# EAGLE design OPEN DROP DIGISCOPE BOARD 1 v2 RELAYS (EAGLE 9.3.0)
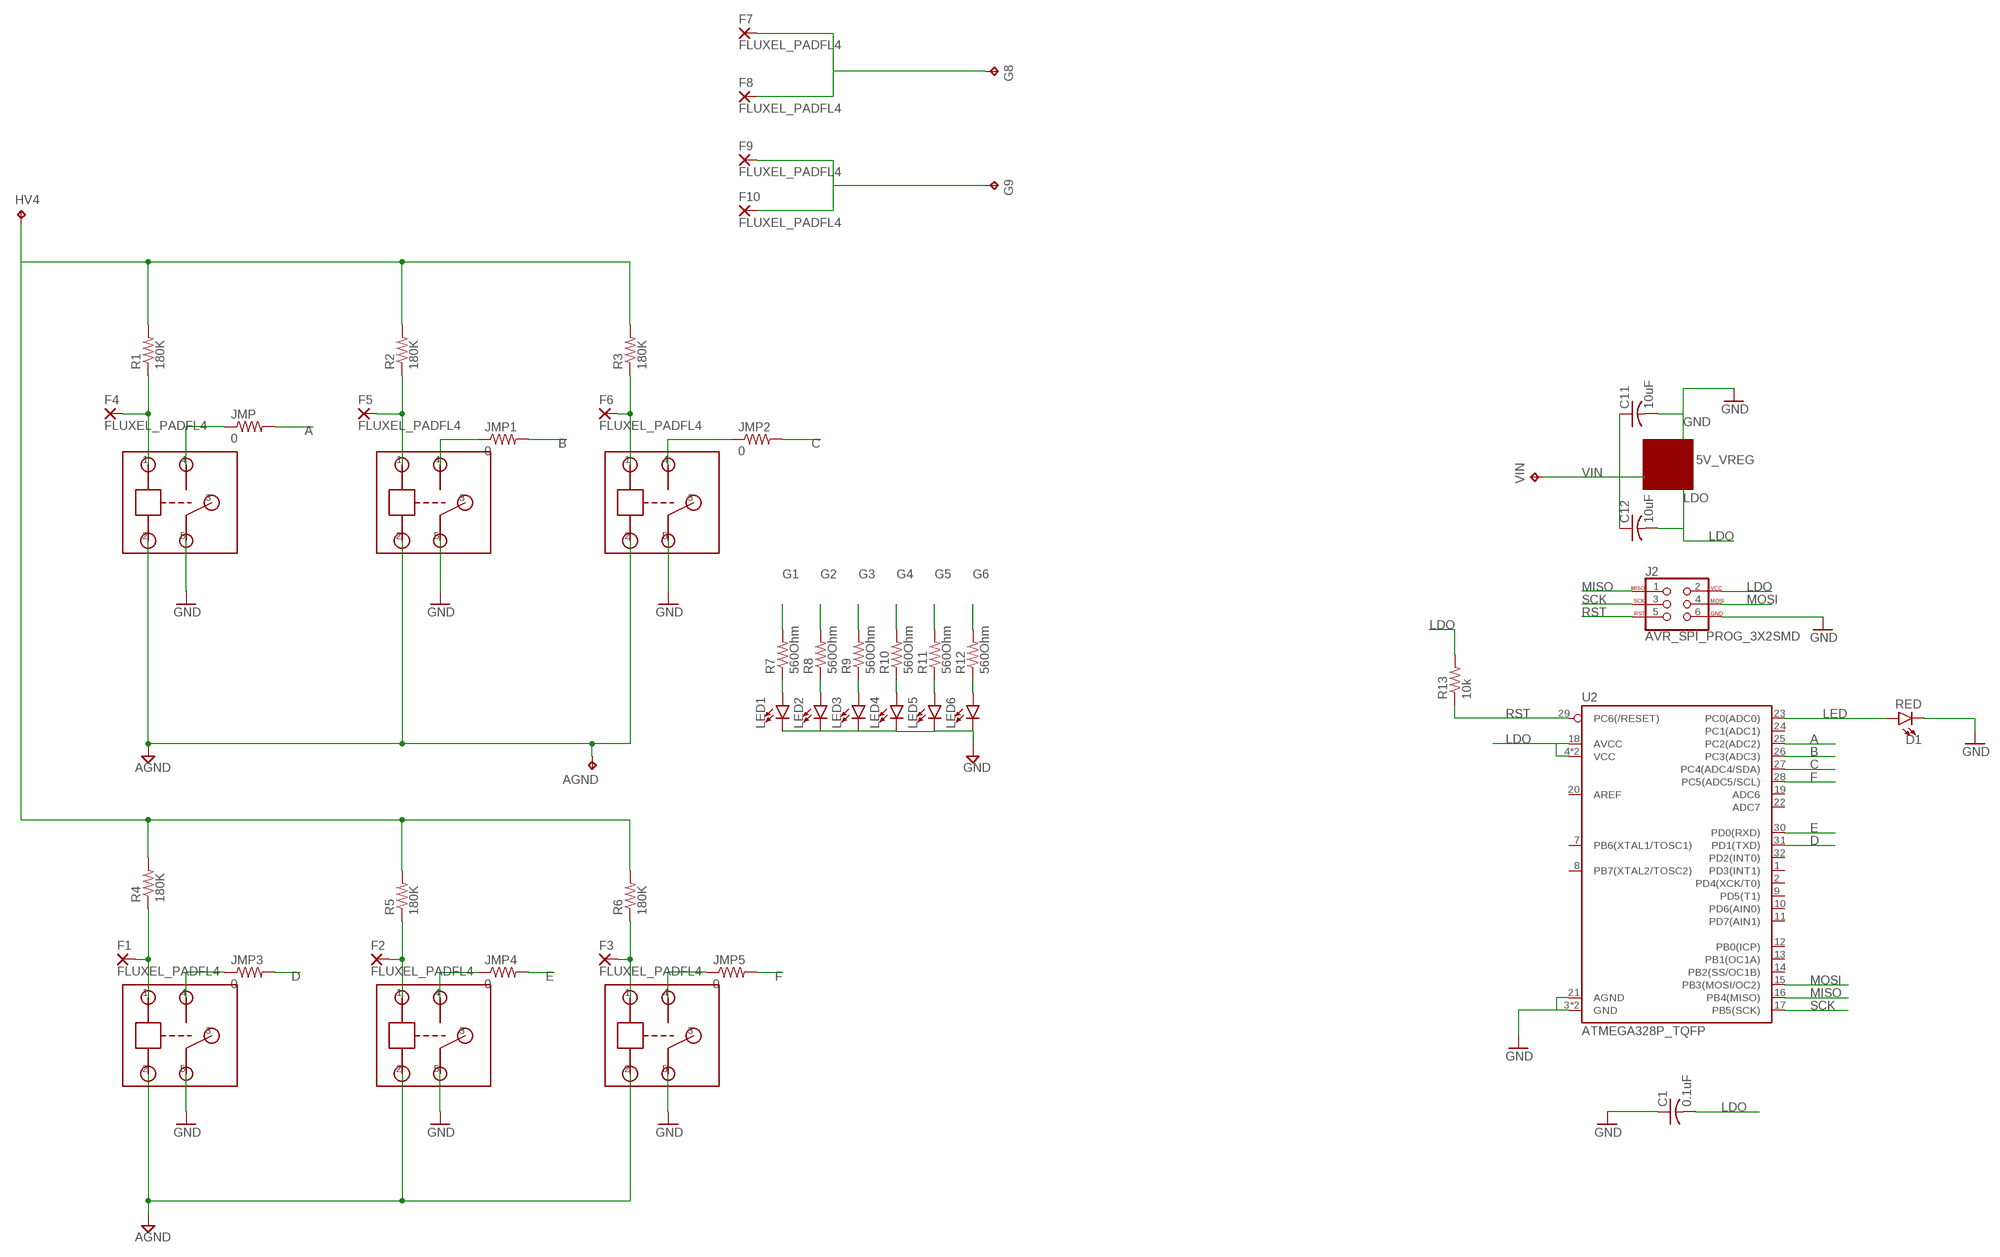
[diagram p0: schematic, sheet 1]

## Parts
5V_VREG  MOSFET_PCH-DMG2305UX-7  [SOT23-3]
AGND  TPB2,54  [B2,54]
C1  0.1uF  C-USC1206  [C1206]
C11  10uF  C-USC1206  [C1206]
C12  10uF  C-USC1206  [C1206]
D1  RED  LED-RED1206  [LED-1206]
F1  FLUXEL_PADFL4  [FLUXEL_PAD4]
F2  FLUXEL_PADFL4  [FLUXEL_PAD4]
F3  FLUXEL_PADFL4  [FLUXEL_PAD4]
F4  FLUXEL_PADFL4  [FLUXEL_PAD4]
F5  FLUXEL_PADFL4  [FLUXEL_PAD4]
F6  FLUXEL_PADFL4  [FLUXEL_PAD4]
F7  FLUXEL_PADFL4  [FLUXEL_PAD4]
F8  FLUXEL_PADFL4  [FLUXEL_PAD4]
F9  FLUXEL_PADFL4  [FLUXEL_PAD4]
F10  FLUXEL_PADFL4  [FLUXEL_PAD4]
G8  TPB2,54  [B2,54]
G9  TPB2,54  [B2,54]
HV4  TPB2,54  [B2,54]
J2  AVR_SPI_PROG_3X2SMD  [2X3_SMT_POSTS]
JMP  0  R-US_M1206  [M1206]
JMP1  0  R-US_M1206  [M1206]
JMP2  0  R-US_M1206  [M1206]
JMP3  0  R-US_M1206  [M1206]
JMP4  0  R-US_M1206  [M1206]
JMP5  0  R-US_M1206  [M1206]
LED1  LED1206  [LED-1206]
LED2  LED1206  [LED-1206]
LED3  LED1206  [LED-1206]
LED4  LED1206  [LED-1206]
LED5  LED1206  [LED-1206]
LED6  LED1206  [LED-1206]
R1  180K  R-US_M1206  [M1206]
R2  180K  R-US_M1206  [M1206]
R3  180K  R-US_M1206  [M1206]
R4  180K  R-US_M1206  [M1206]
R5  180K  R-US_M1206  [M1206]
R6  180K  R-US_M1206  [M1206]
R7  560Ohm  R-US_M1206  [M1206]
R8  560Ohm  R-US_M1206  [M1206]
R9  560Ohm  R-US_M1206  [M1206]
R10  560Ohm  R-US_M1206  [M1206]
R11  560Ohm  R-US_M1206  [M1206]
R12  560Ohm  R-US_M1206  [M1206]
R13  10k  R-US_R1206  [R1206]
U2  ATMEGA328P_TQFP  [TQFP32-08]
U$1  RELAY  [RELAY]
U$2  RELAY  [RELAY]
U$3  RELAY  [RELAY]
U$4  RELAY  [RELAY]
U$5  RELAY  [RELAY]
U$6  RELAY  [RELAY]
VIN  TPB2,54  [B2,54]

## Nets
A: JMP.2 U2.25(PC2(ADC2))
AGND: AGND.TP U$1.2(GND) U$2.2(GND) U$3.2(GND) U$4.2(GND) U$5.2(GND) U$6.2(GND)
B: JMP1.2 U2.26(PC3(ADC3))
C: JMP2.2 U2.27(PC4(ADC4/SDA))
D: JMP3.2 U2.31(PD1(TXD))
E: JMP4.2 U2.30(PD0(RXD))
F: JMP5.2 U2.28(PC5(ADC5/SCL))
G1: JMP3.1 R7.2 U$6.4(COM-OPEN)
G2: JMP4.1 R8.2 U$5.4(COM-OPEN)
G3: JMP5.1 R9.2 U$4.4(COM-OPEN)
G4: JMP.1 R10.2 U$3.4(COM-OPEN)
G5: JMP1.1 R11.2 U$2.4(COM-OPEN)
G6: JMP2.1 R12.2 U$1.4(COM-OPEN)
GND: 5V_VREG.3(D) C1.1 C11.2 D1.C J2.6 LED1.C LED2.C LED3.C LED4.C LED5.C LED6.C U2.3(GND) U2.5(GND) U2.21(AGND) U$1.5(COM-CLOSE) U$2.5(COM-CLOSE) U$3.5(COM-CLOSE) U$4.5(COM-CLOSE) U$5.5(COM-CLOSE) U$6.5(COM-CLOSE)
LDO: 5V_VREG.2(S) C1.2 C12.2 J2.2 R13.2 U2.4(VCC) U2.6(VCC) U2.18(AVCC)
LED: D1.A U2.23(PC0(ADC0))
MISO: J2.1 U2.16(PB4(MISO))
MOSI: J2.4 U2.15(PB3(MOSI/OC2))
N$1: F4.1(P) R1.1 U$3.1(IN)
N$2: F5.1(P) R2.1 U$2.1(IN)
N$3: F6.1(P) R3.1 U$1.1(IN)
N$4: HV4.TP R1.2 R2.2 R3.2 R4.2 R5.2 R6.2
N$5: F1.1(P) R4.1 U$6.1(IN)
N$6: F2.1(P) R5.1 U$5.1(IN)
N$7: F3.1(P) R6.1 U$4.1(IN)
N$14: F7.1(P) F8.1(P) G8.TP
N$15: F9.1(P) F10.1(P) G9.TP
N$16: LED1.A R7.1
N$17: LED2.A R8.1
N$18: LED3.A R9.1
N$19: LED4.A R10.1
N$20: LED5.A R11.1
N$21: LED6.A R12.1
RST: J2.5 R13.1 U2.29(PC6(/RESET))
SCK: J2.3 U2.17(PB5(SCK))
VIN: 5V_VREG.1(G) C11.1 C12.1 VIN.TP
Unconnected: U2.1(PD3(INT1)) U2.2(PD4(XCK/T0)) U2.7(PB6(XTAL1/TOSC1)) U2.8(PB7(XTAL2/TOSC2)) U2.9(PD5(T1)) U2.10(PD6(AIN0)) U2.11(PD7(AIN1)) U2.12(PB0(ICP)) U2.13(PB1(OC1A)) U2.14(PB2(SS/OC1B)) U2.19(ADC6) U2.20(AREF) U2.22(ADC7) U2.24(PC1(ADC1)) U2.32(PD2(INT0)) U$1.3(COM) U$2.3(COM) U$3.3(COM) U$4.3(COM) U$5.3(COM) U$6.3(COM)

## Library data of the parts
5V_VREG = SparkFun-DiscreteSemi:MOSFET_PCH: P-channel MOSFETs Voltage controlled devices that allow control of high current outputs. SparkFun Products: SparkFun ESP32 Thing <https://www.sparkfun.com/products/13907> SparkFun ESP8266 Thing <https://www.sparkfun.com/products/13231> SparkFun Pi Servo HAT V2 <https://www.sparkfun.com/products/15316> DMG2305UX-7 (20V/4.2A/SOT23-3); PROD_ID: TRAN-14388; VALUE: 20V/4.2A/52mΩ/1.4W
AGND G8 G9 HV4 VIN = testpad:TP: Test pad
C1 C11 C12 = adafruit:C-US: CAPACITOR, American symbol
D1 = SparkFun-LED:LED-RED: Red SMD LED Used in manufacturing of most products at SparkFun Packages: 0603 - SMD 0603 package [Product Link] <http://docs.avagotech.com/docs/AV02-0551EN> 0603 SMART - SMD 0603 SMART package ( more efficient and expensive)[Product Link] <http://www.osram-os.com/Graphics/XPic2/00077099_0.pdf> 1206 - SMD1206 package [Product Link] <https://www.sparkfun.com/datasheets/DevTools/LilyPad/Q150OVS4.pdff> SparkFun Products: Pro Mini 328 -5V <https://www.sparkfun.com/products/821> RedBoard <https://www.sparkfun.com/products/12757> IOIO-OTG <https://www.sparkfun.com/products/13613>; PROD_ID: DIO-09912
F1-F10 = Gaudi:FLUXEL_PAD
J2 = SparkFun-Connectors:AVR_SPI_PROG_3X2: AVR ISP 6 Pin This is the reduced ISP connector for AVR programming. Common on Arduino. This footprint will take up less PCB space and can be used with a 10-pin to 6-pin adapter such as SKU: BOB-08508 **Special note about "TEST_POINT" package. The stop mask is on the top side, so if you want your programming test points to be on the bottom of your board, make sure to place this package on the bottom side of the board. This also ensure that the orientation to program from the bottom side will be correct. SparkFun Products: SparkFun ISP Pogo Adapter <https://www.sparkfun.com/products/11591> - NS Tiny AVR Programmer <https://www.sparkfun.com/products/11801> -PTH
JMP JMP1-JMP5 R1-R13 = adafruit:R-US_: RESISTOR, American symbol
LED1-LED6 = SparkFun-LED:LED: LED (Generic) Standard schematic elements and footprints for 5mm, 3mm, 1206, and 0603 sized LEDs. Generic LEDs with no color specified.
U2 = SparkFun-IC-Microcontroller:ATMEGA328P_TQFP: Popular 328P in QFP Storefront component: ATmega328 - TQFP <https://www.sparkfun.com/products/13448> (COM-13448) Datasheet <http://www.sparkfun.com/datasheets/Components/SMD/ATMega328.pdf> SparkFun Products SparkFun RedBoard - Programmed with Arduino <https://www.sparkfun.com/products/12757> (DEV-12757) Arduino Pro Mini 328 - 5V/16MHz <https://www.sparkfun.com/products/11113> (DEV-11113) Arduino Pro Mini 328 - 3.3V/8MHz <https://www.sparkfun.com/products/11114> (DEV-11114) SparkFun OpenLog <https://www.sparkfun.com/products/13712> (DEV-13712) SparkFun MicroView - OLED Arduino Module <https://www.sparkfun.com/products/12923> (DEV-12923) SparkFun Digital Sandbox <https://www.sparkfun.com/products/12651> (DEV-12651) SparkFun PicoBoard <https://www.sparkfun.com/products/11888> (WIG-11888) Arduino Fio <https://www.sparkfun.com/products/10116> (DEV-10116) LilyPad Arduino 328 Main Board <https://www.sparkfun.com/products/13342> (DEV-13342) SparkFun RedStick <https://www.sparkfun.com/products/13741> (DEV-13741) LilyPad MP3 <https://www.sparkfun.com/products/11013> (DEV-11013) LilyPad Arduino SimpleSnap <https://www.sparkfun.com/products/10941> (DEV-10941) SparkFun Stepoko <https://www.sparkfun.com/products/13899> (ROB-13899) SparkFun Geiger Counter <https://www.sparkfun.com/products/11345> (SEN-11345) SparkFun EL Sequencer <https://www.sparkfun.com/products/12781> (COM-12781) Arduino Pro 328 - 5V/16MHz <https://www.sparkfun.com/products/10915> (DEV-10915) CryptoCape <https://www.sparkfun.com/products/12773> (DEV-12773) SparkFun IR Thermometer Evaluation Board - MLX90614 <https://www.sparkfun.com/products/10740> (SEN-10740) SparkFun RedBot Mainboard <https://www.sparkfun.com/products/12097> (ROB-12097) Arduino Pro 328 - 3.3V/8MHz <https://www.sparkfun.com/products/10914> (DEV-10914) SparkFun Block for Intel® Edison - Arduino <https://www.sparkfun.com/products/13036> (DEV-13036) SparkFun Simon Says - Surface Mount Soldering Kit <https://www.sparkfun.com/products/10935> (KIT-10935) SparkFun 7-Segment Serial Display - Red <https://www.sparkfun.com/products/11441> (COM-11441) SparkFun 7-Segment Serial Display - White <https://www.sparkfun.com/products/11629> (COM-11629) SparkFun 7-Segment Serial Display - Yellow <https://www.sparkfun.com/products/11443> (COM-11443) SparkFun 7-Segment Serial Display - Kelly Green <https://www.sparkfun.com/products/11440> (COM-11440) SparkFun 7-Segment Serial Display - Blue <https://www.sparkfun.com/products/11442> (COM-11442) SparkFun OpenSegment Serial Display - 20mm (Blue) <https://www.sparkfun.com/products/11647> (COM-11647) SparkFun OpenSegment Serial Display - 20mm (Green) <https://www.sparkfun.com/products/11646> (COM-11646) SparkFun OpenSegment Serial Display - 20mm (White) <https://www.sparkfun.com/products/11648> (COM-11648) SparkFun OpenSegment Serial Display - 20mm (Red) <https://www.sparkfun.com/products/11644> (COM-11644) SparkFun OpenSegment Serial Display - 20mm (Yellow) <https://www.sparkfun.com/products/11645> (COM-11645) SparkFun OpenSegment Shield <https://www.sparkfun.com/products/13190> (DEV-13190); PROD_ID: IC-09069
U$1-U$6 = RELAY 2:RELAY

## Board
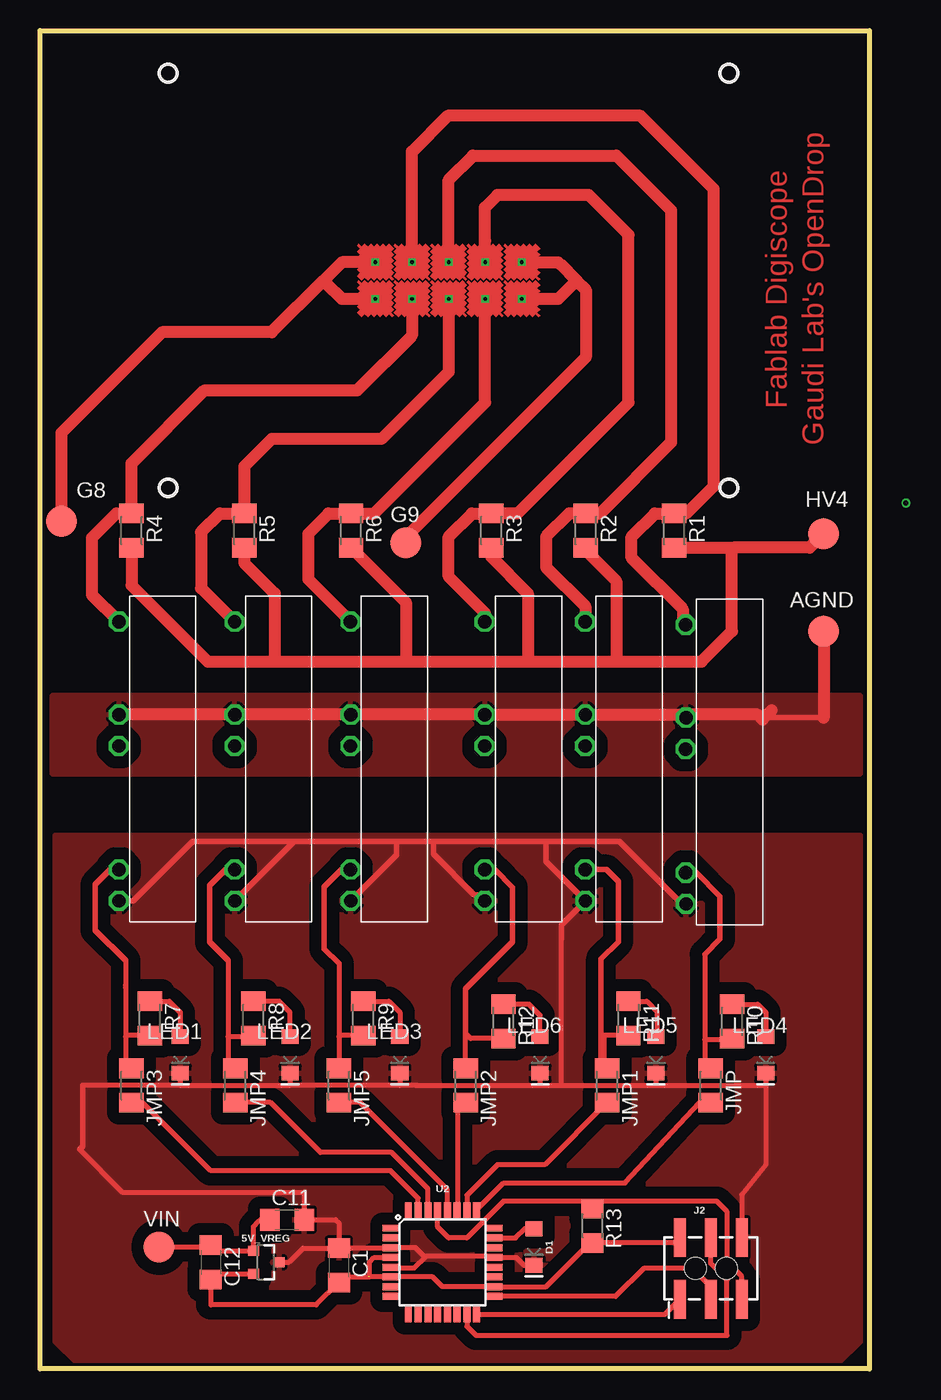
[diagram p1: board, top side]
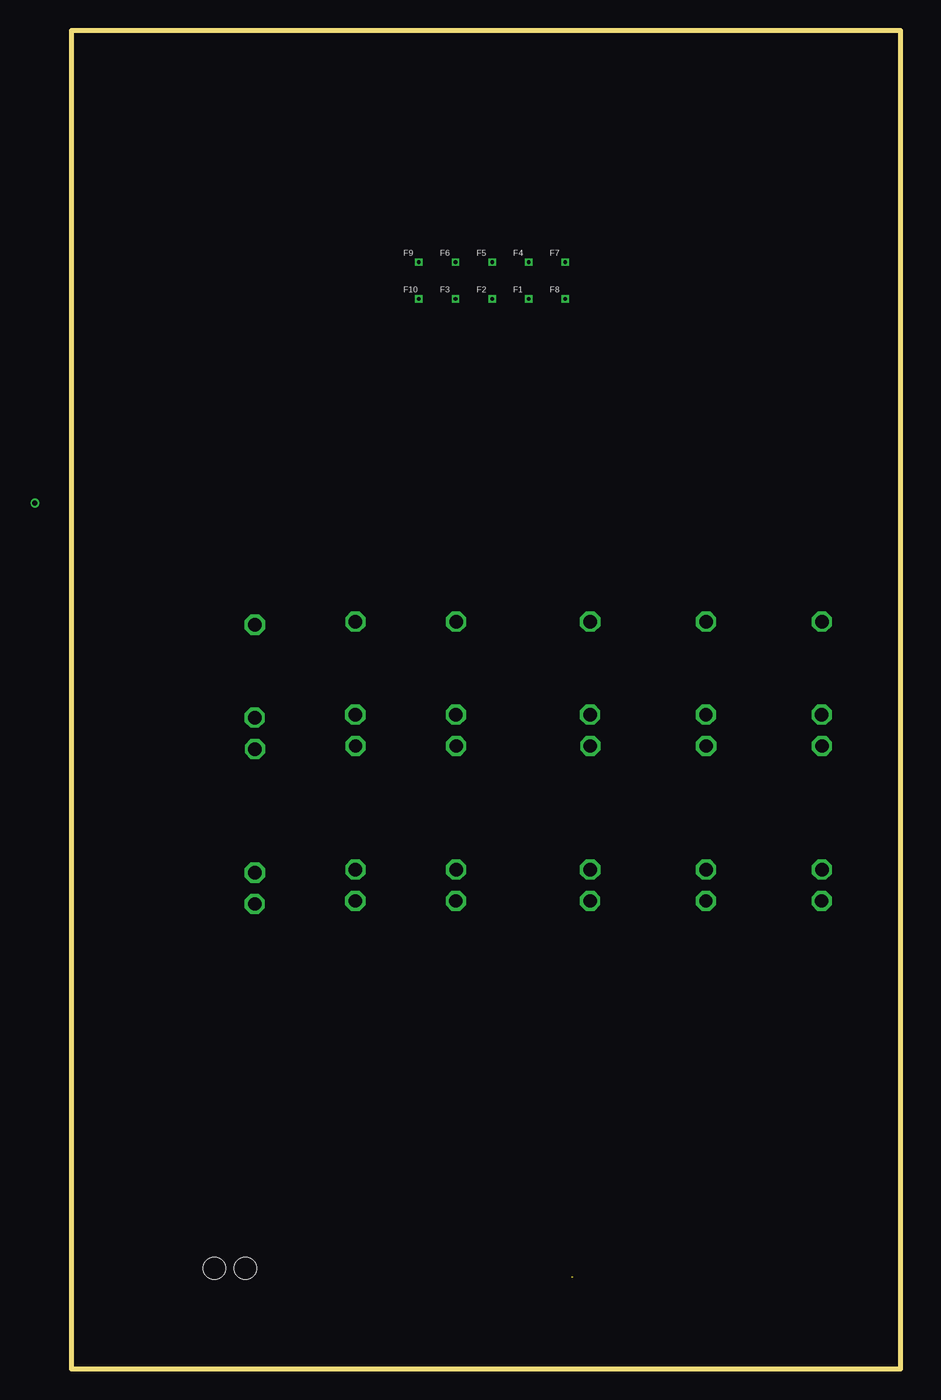
[diagram p2: board, bottom side, seen from below]

Size 68 x 109.75 mm. Coordinates in mm from the lower left corner, seen from the top.
Outline: 0,109.75 68,109.75 68,0 0,0 0,109.75
Copper layers (1*2*15*16): Top 0.035mm / dielectric 0.2mm / Route2 0.0175mm / dielectric 1.1mm / Route15 0.0175mm / dielectric 0.2mm / Bottom 0.035mm
Design rules "SeeedStudio_DRU_no_angle_20130527 *": minimum track width 0.464mm, minimum drill 16mil, track to track 1mm, track to pad 1mm, pad to pad 1mm, via to via 1mm, smd to smd 1mm, copper to edge 10mil, drill to drill 10mil, minimum pad ring 6mil, minimum via ring 6mil, stop-mask expansion 2mil, vias tented up to drill 25mil, thermal gap 10mil

### Footprints (pad centres in the part's own frame; a part is rotated, then mirrored left to right if it is on the bottom)
SOT23-3 = smd 0.8 x 0.9: 1 -0.95,-1; 2 0.95,-1; 3 0,1.1
B2,54 = smd 2.54 x 2.54: TP 0,0
C1206 = smd 1.6 x 1.8: 1 -1.4,0; 2 1.4,0
LED-1206 = smd 1.2 x 1.4: A -1.5,0; C 1.5,0
FLUXEL_PAD4 = drill 0.3 square: 1 0,0
2X3_SMT_POSTS = smd 1 x 3.17: 1 -2.54,-2.54; 2 -2.54,2.54; 3 0,-2.54; 4 0,2.54; 5 2.54,-2.54; 6 2.54,2.54 | hole 1.8: -1.27,0; 1.27,0
M1206 = smd 1.6 x 2: 1 -1.4,0; 2 1.4,0
R1206 = smd 1.6 x 1.803: 1 -1.422,0; 2 1.422,0
TQFP32-08 = smd 1.27 x 0.559: 1 -4.293,2.8; 2 -4.293,2; 3 -4.293,1.2; 4 -4.293,0.4; 5 -4.293,-0.4; 6 -4.293,-1.2; 7 -4.293,-2; 8 -4.293,-2.8; 17 4.293,-2.8; 18 4.293,-2; 19 4.293,-1.2; 20 4.293,-0.4; 21 4.293,0.4; 22 4.293,1.2; 23 4.293,2; 24 4.293,2.8 | smd 0.559 x 1.27: 9 -2.8,-4.293; 10 -2,-4.293; 11 -1.2,-4.293; 12 -0.4,-4.293; 13 0.4,-4.293; 14 1.2,-4.293; 15 2,-4.293; 16 2.8,-4.293; 25 2.8,4.293; 26 2,4.293; 27 1.2,4.293; 28 0.4,4.293; 29 -0.4,4.293; 30 -1.2,4.293; 31 -2,4.293; 32 -2.8,4.293
RELAY = drill 1.1 octagon: 1 -0.025,-0.045; 2 7.595,-0.031; 3 10.167,-0.051; 4 20.303,-0.045; 5 22.868,-0.031

### Placement (x,y rotation side)
5V_VREG  18.5,8.75 270 top
AGND  64.25,60.5 0 top
C1  24.5,8.5 270 top
C11  20.25,12.25 0 top
C12  14,8.75 270 top
D1  40.5,10 270 top
F1  30.5,87.75 0 bottom
F2  33.5,87.75 0 bottom
F3  36.5,87.75 0 bottom
F4  30.5,90.75 0 bottom
F5  33.5,90.75 0 bottom
F6  36.5,90.75 0 bottom
F7  27.5,90.75 0 bottom
F8  27.5,87.75 0 bottom
F9  39.5,90.75 0 bottom
F10  39.5,87.75 0 bottom
G8  1.75,69.5 0 top
G9  30,67.75 0 top
HV4  64.25,68.5 0 top
J2  55,8.25 0 top
JMP  55,23.25 270 top
JMP1  46.5,23.25 270 top
JMP2  34.9,23.25 270 top
JMP3  7.5,23.25 270 top
JMP4  16,23.25 270 top
JMP5  24.5,23.25 270 top
LED1  11.5,25.75 270 top
LED2  20.5,25.75 270 top
LED3  29.5,25.75 270 top
LED4  59.5,25.75 270 top
LED5  50.5,25.75 270 top
LED6  41,25.75 270 top
R1  52,68.75 270 top
R2  44.75,68.75 270 top
R3  37,68.75 270 top
R4  7.5,68.75 270 top
R5  16.75,68.75 270 top
R6  25.5,68.75 270 top
R7  9,28.75 270 top
R8  17.5,28.75 270 top
R9  26.5,28.75 270 top
R10  56.75,28.5 270 top
R11  48.25,28.75 270 top
R12  38,28.5 270 top
R13  45.29,11.75 270 top
U2  33,8.75 0 top
U$1  36.5,61.25 270 top
U$2  44.75,61.25 270 top
U$3  53,61 270 top
U$4  25.5,61.25 270 top
U$5  16,61.25 270 top
U$6  6.5,61.25 270 top
VIN  9.75,10 0 top

### Tracks (layer width: path | path; a pad name or v marks a point on that pad's centre or on a via)
A
  Top 0.406: U2.25 38.01,15.25 47.97,15.25 54.1,21.85 JMP.2
AGND
  Top 0.464: 64.25,53.41 59.25,53.41 U$3.2 | U$2.2 44.75,53.66
  Top 1: U$6.2 U$1.2 44.75,53.66 52.72,53.66 U$3.2 53.22,53.66 58.84,53.66 59.25,53.25 | 60,54 59.25,53.25 | 59.25,53.41 59.25,53.25 | AGND.TP 64.25,53.41
  pour Top: 1,55.25 67.25,55.25 67.25,48.75 1,48.75
B
  Top 0.406: JMP1.2 41.4,16.75 37.5,16.75 35,14.25 U2.26
C
  Top 0.406: U2.27 34.23,13.08 34.23,21.18 JMP2.2
D
  Top 0.406: U2.31 31,14 28.75,16.25 14,16.25 8.5,21.75 7,21.75 7.1,21.85 JMP3.2
E
  Top 0.406: U2.30 31.8,14.78 28.83,17.75 23,17.75 18.9,21.85 JMP4.2
F
  Top 0.406: U2.28 33.4,14.7 26.25,21.85 JMP5.2
G1
  Top 0.406: 7,33.5 7,31.46 7,31.25 7,27.25 | 7,27.25 7,25.15 JMP3.1 | 7,27.25 7.1,27.35 R7.2
  Top 0.464: U$6.4 5.75,40.95 4.53,39.73 4.53,35.97 7,33.5
G2
  Top 0.406: 15.42,33.5 15.42,27.25 | 15.42,27.25 15.42,25.23 JMP4.1 | R8.2 17.4,27.25 15.42,27.25
  Top 0.464: U$5.4 15.2,40.95 13.91,39.66 13.91,35 15.42,33.5
G3
  Top 0.406: 24.5,33.25 24.5,27.25 | 24.5,27.25 JMP5.1 | R9.2 24.6,27.35 24.5,27.25
  Top 0.464: 24.5,33.25 23.3,34.45 23.3,39.54 24.7,40.95 U$4.4
G4
  Top 0.406: 54.5,34 54.5,27 | 54.5,27 54.5,25.15 JMP.1 | R10.2 56.65,27 54.5,27
  Top 0.464: U$3.4 53.8,40.7 55.75,38.75 55.75,35.25 54.5,34
G5
  Top 0.406: 46.25,24.9 46.25,27.35 R11.2 | 46,25.15 46.25,24.9 | 46.25,24.9 JMP1.1
  Top 0.464: 46,25.15 46,33.63 47.41,35.04 47.41,39.99 46.45,40.95 U$2.4
G6
  Top 0.406: JMP2.1 34.9,27.5 | 34.9,27.5 34.9,28.9 34.9,31.11 | R12.2 35.3,27.1 34.9,27.5
  Top 0.464: 34.9,27.5 34.9,31.15 38.75,35 38.75,39.5 37.3,40.95 U$1.4
GND
  Top 0.406: 11.5,23.25 20.5,23.25 | 31,23.25 29.5,23.25 | 29.5,23.25 20.5,23.25 | 42.75,23.25 42.75,35.25 42.75,35.46 | 11.5,23.25 3.5,23.25 | LED1.C 11.5,23.25 | LED2.C 20.5,23.25 | LED3.C 29.5,23.25 | 31.63,9.25 37.19,9.25 U2.21 39.04,9.15 39.69,8.5 D1.C | 31.63,9.25 31.5,9.25 30.8,9.95 U2.3 24.55,9.95 C1.1 | U2.5 28.78,8.28 30.66,8.28 31.63,9.25 | C1.1 21.55,9.9 20.4,8.75 5V_VREG.3 | C11.2 21.79,12.25 | 3.25,18 6.75,14.5 21.65,14.5 C11.2 | LED4.C 59.5,23.25 | 59.5,23.25 59.5,16.75 57.54,14.29 J2.6 | 30.81,23.25 41,23.25 | 41,23.25 42.75,23.25 | 42.75,23.25 50.5,23.25 | 50.5,23.25 59.5,23.25 | C11.2 24.25,12.25 24.5,12 C1.1 | LED6.C 41,23.25 | LED5.C 50.5,23.25
  Top 0.464: U$3.5 52.62,38.13 47.5,43.25 41.5,43.25 | 41.5,43.25 41.5,41.6 U$2.5 42.75,36.41 42.75,35.25 | U$6.5 7.63,38.38 12.5,43.25 20.84,43.25 | 20.84,43.25 29.25,43.25 | 29.25,43.25 32.25,43.25 | 32.25,43.25 41.5,43.25 | U$5.5 20.84,43.25 | U$4.5 29.25,42.16 29.25,43.25 | 3.5,23.25 3.5,18.25 3.25,18 | U$1.5 35.96,38.89 35.6,38.89 32.25,42.24 32.25,43.25
  pour Top: 1.25,43.75 1.25,2.25 3,0.5 65.5,0.5 67.25,2.25 67.25,43.75
LDO  (1 unrouted)
  Top 0.406: 26.89,7.54 U2.6 32.2,7.55 33,6.75 U2.18 41.5,6.75 45.08,10.33 R13.2 | U2.4 27.4,9.15 27,8.75 27,7.54 24.95,7.54 C1.2 22.65,5.25 14,5.25 C12.2 13.9,7.35 13.5,7.75 17.45,7.75 5V_VREG.2 | 45.03,10.28 R13.2 | J2.2 52,10.33 R13.2
LED
  Top 0.406: U2.23 39,10.75 39.75,11.5 D1.A
MISO
  Top 0.406: J2.1 51.21,4.46 U2.16
MOSI
  Top 0.406: U2.15 35,3.5 35.75,2.75 56.34,2.75 56.34,7.31 55,8.65 J2.4
N$1
  Top 0.464: F4.1 30.5,92.01 30.48,92.03
  Top 1: 52.75,61.23 U$3.1 52.7,61.28 52.7,62.3 48.5,66.5 48.5,68.25 50.4,70.15 R1.1 53,70.15 55.25,72.4 55.25,96.75 49.25,102.75 33.42,102.75 30.48,99.81 30.48,92.03
N$2
  Top 1: F5.1 33.5,97.5 35.5,99.5 47.25,99.5 51.75,95 51.75,76 45.9,70.15 R2.1 | U$2.1 44.7,62.53 41.5,65.73 41.5,68.25 43.4,70.15 R2.1 | 44.65,70.25 R2.1
N$3
  Top 1: U$1.1 36.45,62.03 33.5,64.98 33.5,68.25 35.4,70.15 R3.1 39.15,70.15 48.25,79.25 48.25,93 45,96.25 37.5,96.25 36.48,95.23 36.48,92.53 36.5,92.51 F6.1
N$4
  Top 1: R4.2 7.5,64.25 13.75,58 19.25,58 | 19.25,58 30,58 | 30,58 40,58 | 40,58 47.25,58 | R5.2 16.75,66.1 19.25,63.6 19.25,58 | R6.2 30,62.85 30,58 | R3.2 37,66.6 40,63.6 40,58 | R2.2 44.75,67.1 47.25,64.6 47.25,58 | R1.2 56.85,67.35 | HV4.TP 63.1,67.35 56.85,67.35 | 47.25,58 54.25,58 56.75,60.5 56.75,67.25 56.85,67.35
N$5
  Top 1: U$6.1 4.25,63.48 4.25,68.15 6.25,70.15 R4.1 7.5,74.25 13.5,80.25 26,80.25 30.5,84.75 F1.1
N$6
  Top 1: U$5.1 13.2,64.03 13.2,68.61 14.75,70.15 R5.1 16.75,74 19,76.25 28,76.25 33.5,81.75 F2.1
N$7
  Top 1: U$4.1 25.45,61.3 22,64.75 22,68.5 23.65,70.15 R6.1 27.4,70.15 36.5,79.25 F3.1
N$10  (via drill 0.41)
  other vias: 71,71
N$14
  Top 0.406: 23.5,89.25 23.5,89 | 23.5,89.25 23.5,89.75 24.5,90.75 F7.1 | 23.5,89.25 23.25,89.25
  Top 1: F7.1 24.75,90.75 23.25,89.25 | 23.25,89.25 19,85 10,85 1.75,76.75 G8.TP | F8.1 24.75,87.75 23.5,89 23.25,89.25
N$15
  Top 0.406: F9.1 40.5,90.75 | 42.5,90.75 42.62,90.62 43.5,89.75 | 42.5,87.75 42.62,87.88 43.5,88.75 | F10.1 40,87.75
  Top 1: 40.5,90.75 42.5,90.75 | 42.62,90.62 44,89.25 | 44,89.25 44.75,88.5 44.75,82.95 30,68.2 G9.TP | 40,87.75 42.5,87.75 | 44,89.25 42.62,87.88
N$16
  Top 0.406: 9.59,29.55 R7.1 10.6,30.15 11.5,29.25 LED1.A
N$17
  Top 0.406: LED2.A 20.5,29.25 19.6,30.15 R8.1
N$18
  Top 0.406: 26.86,29.79 R9.1 28.6,30.15 29.5,29.25 LED3.A
N$19
  Top 0.406: LED4.A 59.85,27.3 59.53,26.98 | 59.53,26.98 59.4,26.85 | R10.1 58.85,29.9 59.53,29.23 59.53,26.98
N$20
  Top 0.406: R11.1 49.75,30.15 50.6,29.3 50.6,27.35 LED5.A
N$21
  Top 0.406: LED6.A 41,29 40.1,29.9 R12.1
RST
  Top 0.406: J2.5 57.5,5.75 57.5,7.65 56.3,8.85 56.3,12.95 55.5,13.75 45.87,13.75 R13.1 44.72,13.75 38,13.75 35,10.75 33.5,10.75 32.6,11.65 U2.29
SCK
  Top 0.406: J2.3 55,6.75 53.5,8.25 49.5,8.25 47.2,5.95 U2.17
VIN
  Top 0.406: C11.1 18.06,12.25 17.85,12.05 17.5,11.7 5V_VREG.1 14.45,9.7 C12.1 13.85,10 VIN.TP

### Text on the board
Top: Fablab Digiscope | Gaudi Lab's OpenDrop